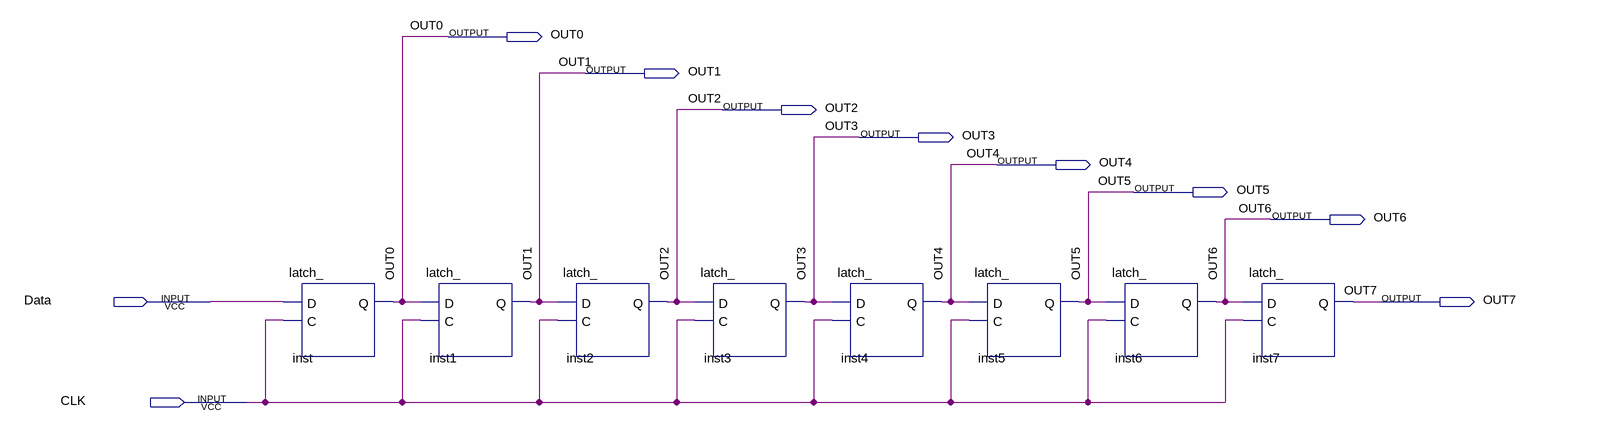
[diagram p0: schematic sheet]
// Quartus schematic RG.bdf as structural Verilog: 8 symbols, 10 pins
module RG (
  input  Data,
  input  CLK,
  output OUT0,
  output OUT1,
  output OUT2,
  output OUT3,
  output OUT4,
  output OUT5,
  output OUT6,
  output OUT7
);

  latch_ inst (.D(Data), .C(CLK), .Q(OUT0));
  latch_ inst1 (.D(OUT0), .C(CLK), .Q(OUT1));
  latch_ inst2 (.D(OUT1), .C(CLK), .Q(OUT2));
  latch_ inst3 (.D(OUT2), .C(CLK), .Q(OUT3));
  latch_ inst4 (.D(OUT3), .C(CLK), .Q(OUT4));
  latch_ inst5 (.D(OUT4), .C(CLK), .Q(OUT5));
  latch_ inst6 (.D(OUT5), .C(CLK), .Q(OUT6));
  latch_ inst7 (.D(OUT6), .C(CLK), .Q(OUT7));
endmodule
